# EAGLE design TIA Schematic 19 Jan 2017 (EAGLE 6.6.0)
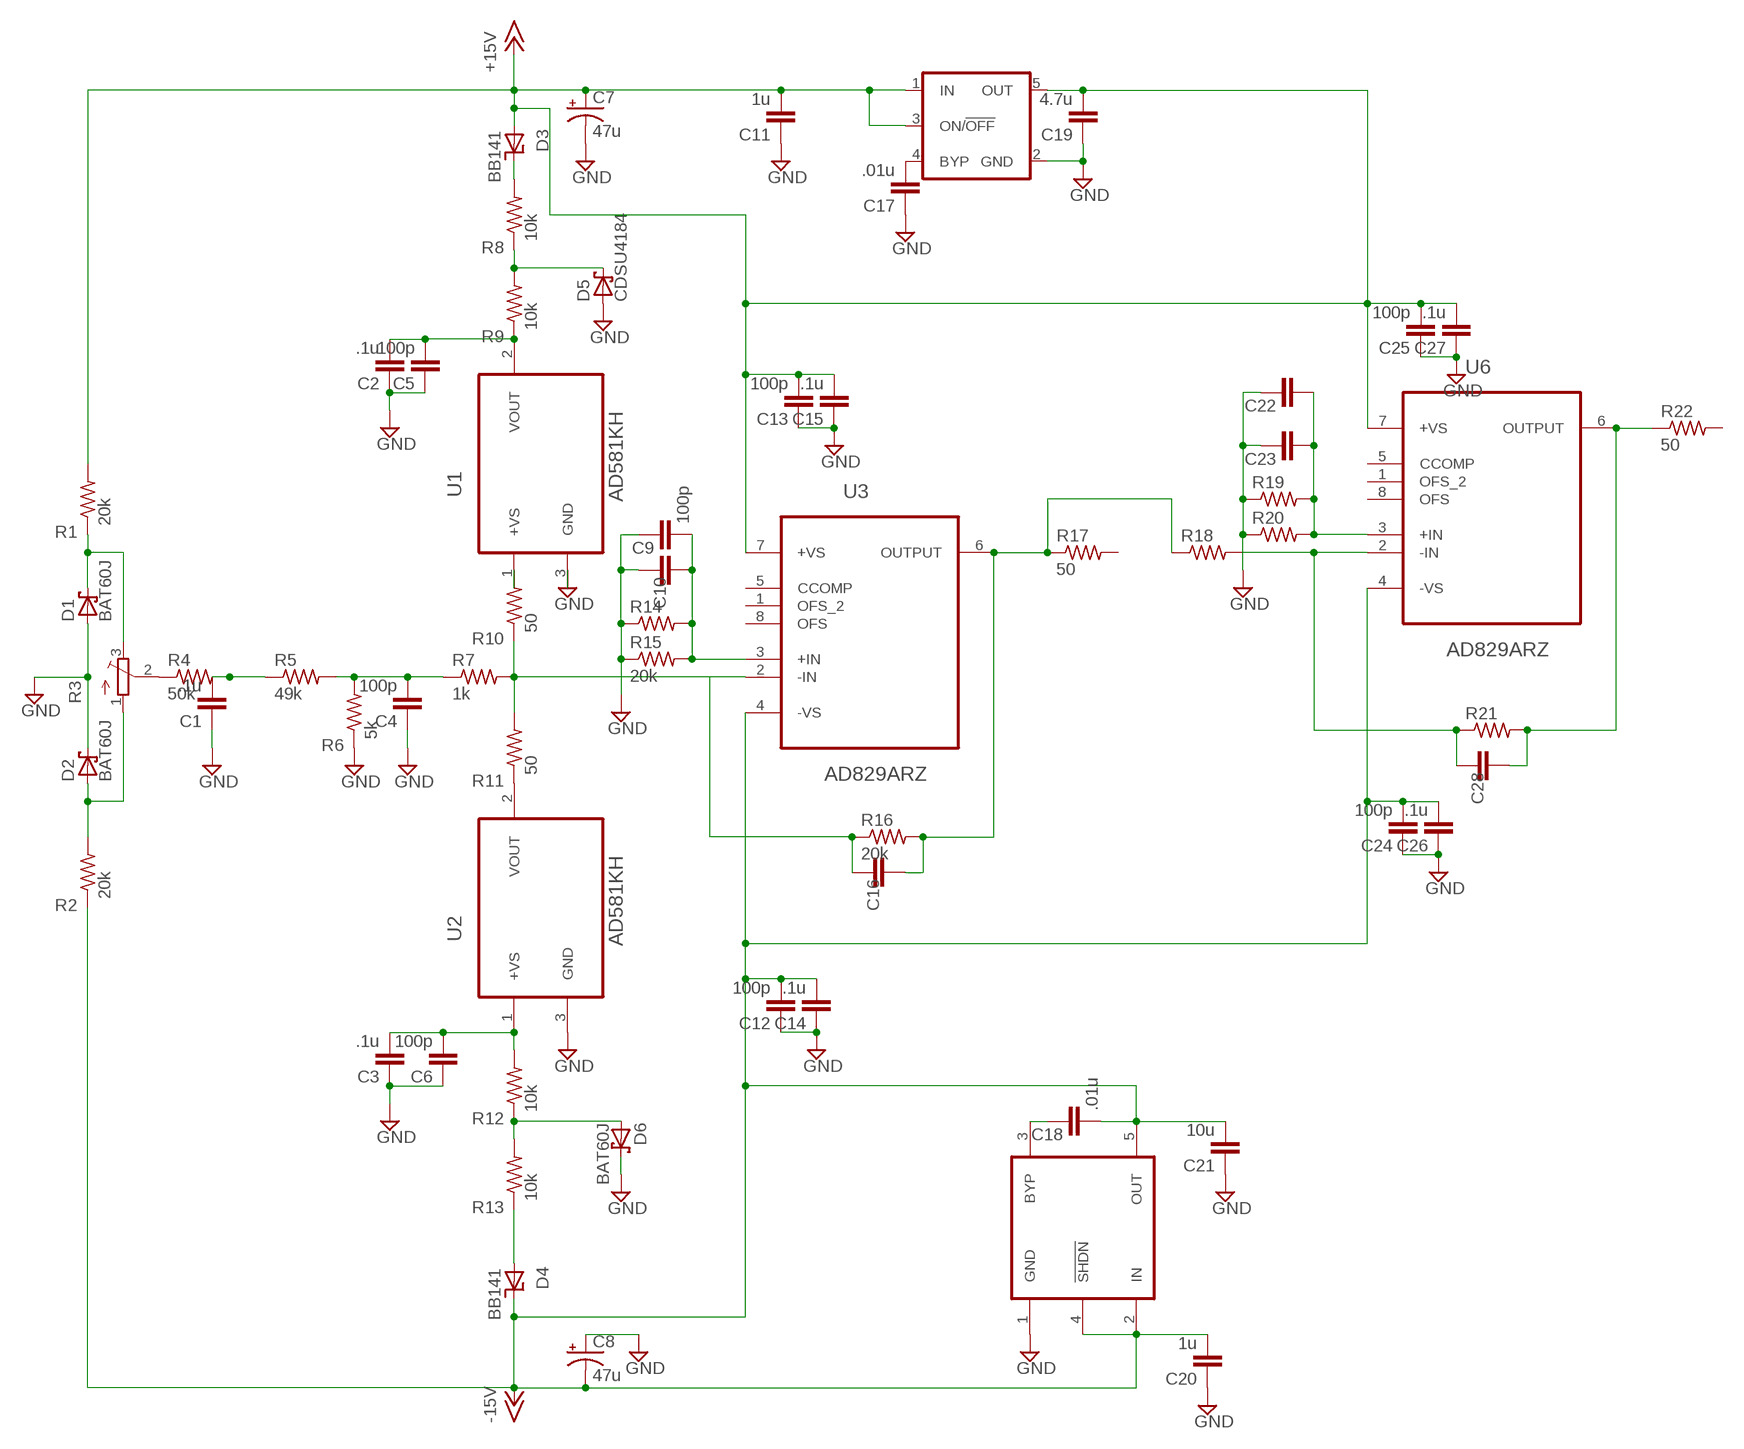
[diagram p0: schematic, sheet 1]

## Parts
C1  .1u  C-EUC0603  [C0603]
C2  .1u  C-EUC0603  [C0603]
C3  .1u  C-EUC0603  [C0603]
C4  100p  C-EUC0603  [C0603]
C5  100p  C-EUC0603  [C0603]
C6  100p  C-EUC0603  [C0603]
C7  47u  CPOL-USETR3  [ETR3]
C8  47u  CPOL-USETR3  [ETR3]
C9  100p  C-EUC0603  [C0603]
C10  C-EUC0603  [C0603]
C11  1u  C-EUC0603  [C0603]
C12  100p  C-EUC0603  [C0603]
C13  100p  C-EUC0603  [C0603]
C14  .1u  C-EUC0603  [C0603]
C15  .1u  C-EUC0603  [C0603]
C16  C-EUC0603  [C0603]
C17  .01u  C-EUC0603  [C0603]
C18  .01u  C-EUC0603  [C0603]
C19  4.7u  C-EUC0603  [C0603]
C20  1u  C-EUC0603  [C0603]
C21  10u  C-EUC0603  [C0603]
C22  C-EUC0603  [C0603]
C23  C-EUC0603  [C0603]
C24  100p  C-EUC0603  [C0603]
C25  100p  C-EUC0603  [C0603]
C26  .1u  C-EUC0603  [C0603]
C27  .1u  C-EUC0603  [C0603]
C28  C-EUC0603  [C0603]
D1  BAT60J  [SOD323_ST]
D2  BAT60J  [SOD323_ST]
D3  BB141  [SOD523]
D4  BB141  [SOD523]
D5  CDSU4184  BAT60J  [SOD323_ST]
D6  BAT60J  [SOD323_ST]
R1  20k  R-US_R0603  [R0603]
R2  20k  R-US_R0603  [R0603]
R3  TRIM_EU-3223G  [3223G]
R4  50k  R-US_R0603  [R0603]
R5  49k  R-US_R0603  [R0603]
R6  5k  R-US_R0603  [R0603]
R7  1k  R-US_R0603  [R0603]
R8  10k  R-US_R0603  [R0603]
R9  10k  R-US_R0603  [R0603]
R10  50  R-US_R0603  [R0603]
R11  50  R-US_R0603  [R0603]
R12  10k  R-US_R0603  [R0603]
R13  10k  R-US_R0603  [R0603]
R14  R-US_R0603  [R0603]
R15  20k  R-US_R0603  [R0603]
R16  20k  R-US_R0603  [R0603]
R17  50  R-US_R0603  [R0603]
R18  R-US_R0603  [R0603]
R19  R-US_R0603  [R0603]
R20  R-US_R0603  [R0603]
R21  R-US_R0603  [R0603]
R22  50  R-US_R0603  [R0603]
U1  AD581KH  [TO254P939X470-3P]
U2  AD581KH  [TO254P939X470-3P]
U3  AD829ARZ  [SOIC127P600X175-8N]
U4  LP2992M5  [SOT23-5]
U5  LT1964  [SOT23-5]
U6  AD829ARZ  [SOIC127P600X175-8N]

## Nets
+15V: C7.+ C11.2 C13.2 C15.2 C19.2 C25.2 C27.2 D3.A R1.2 U3.7(+VS) U4.1(IN) U4.3(ON/!OFF!) U4.5(OUT) U6.7(+VS)
-15V: C8.- C12.2 C14.2 C18.2 C20.2 C21.2 C24.2 C26.2 D4.C R2.1 U3.4(-VS) U5.2(IN) U5.4(!SHDN!) U5.5(OUT) U6.4(-VS)
GND: C1.1 C2.1 C3.1 C4.1 C5.1 C6.1 C7.- C8.+ C9.1 C10.1 C11.1 C12.1 C13.1 C14.1 C15.1 C17.1 C19.1 C20.1 C21.1 C22.1 C23.1 C24.1 C25.1 C26.1 C27.1 D1.A D2.C D5.A D6.C R6.1 R14.1 R15.1 R19.1 R20.1 U1.3(GND) U2.3(GND) U4.2(GND) U5.1(GND)
N$1: D3.C R8.2
N$2: R3.2(S) R4.1
N$3: C4.2 R5.2 R6.2 R7.1
N$4: C1.2 R4.2 R5.1
N$5: C9.2 C10.2 R14.2 R15.2 U3.3(+IN)
N$6: C16.2 R16.2 R17.1 R18.1 U3.6(OUTPUT)
N$7: C16.1 R7.2 R10.1 R11.2 R16.1 U3.2(-IN)
N$8: D5.C R8.1 R9.2
N$9: R10.2 U1.1(+VS)
N$10: R11.1 U2.2(VOUT)
N$11: C3.2 C6.2 R12.2 U2.1(+VS)
N$12: D6.A R12.1 R13.2
N$13: D4.A R13.1
N$14: D1.C R1.1 R3.3(E)
N$15: D2.A R2.2 R3.1(A)
N$17: C2.2 C5.2 R9.1 U1.2(VOUT)
N$22: C28.1 R18.2 R21.1 U6.2(-IN)
N$23: C22.2 C23.2 R19.2 R20.2 U6.3(+IN)
N$24: C17.2 U4.4(BYP)
N$25: C18.1 U5.3(BYP)
N$26: C28.2 R21.2 R22.1 U6.6(OUTPUT)
Unconnected: R17.2 R22.2 U3.1(OFS_2) U3.5(CCOMP) U3.8(OFS) U6.1(OFS_2) U6.5(CCOMP) U6.8(OFS)

## Library data of the parts
C1-C6 C9-C28 = rcl:C-EU: CAPACITOR, European symbol
C7 C8 = rcl:CPOL-US: POLARIZED CAPACITOR, American symbol
D1 D2 D5 D6 = diode:BAT60J: Schottky barrier diode Source: www.st.com, BAT60J.pdf
D3 D4 = mylibrary:BB141: Diode SOD-523
R1 R2 R4-R22 = rcl:R-US_: RESISTOR, American symbol
R3 = pot:TRIM_EU-: POTENTIOMETER
U1 U2 = Analog Devices_By_element14_Batch_1:AD581KH: High Precision 10 V IC Reference; MPN: AD581KH; OC_FARNELL: 4414640; OC_NEWARK: 05F7034; PACKAGE: TO-5-3; SUPPLIER: Analog Devices
U3 U6 = Analog Devices_By_element14_Batch_1:AD829ARZ: High Speed, Low Noise Video Op Amp; MPN: AD829ARZ; OC_FARNELL: 1651322; OC_NEWARK: 82H3000; PACKAGE: SOIC-8; SUPPLIER: Analog Devices
U4 = LP2992M5:LP2992M5
U5 = LT1964:LT1964

## Board
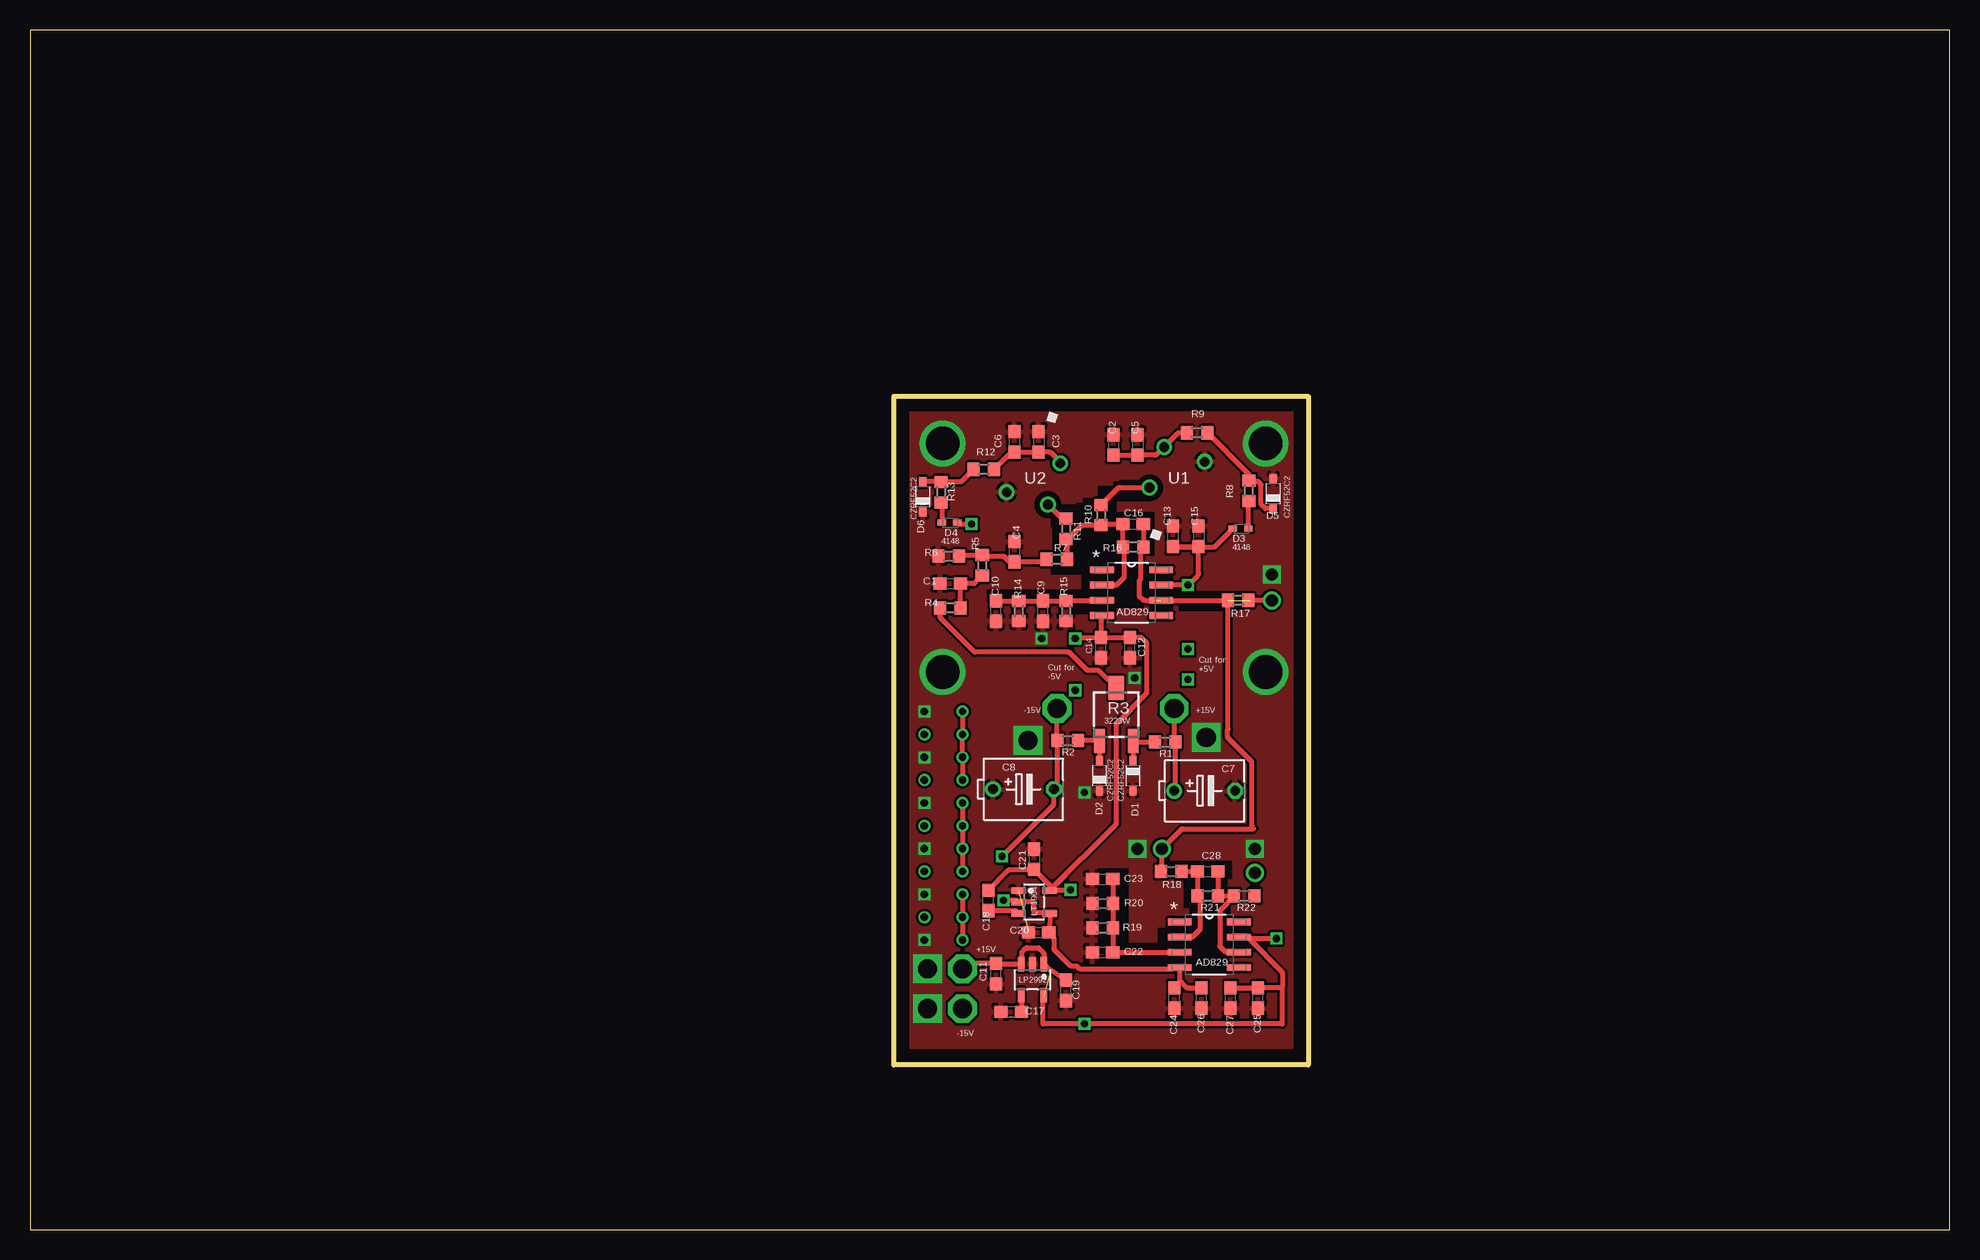
[diagram p1: board, top side]
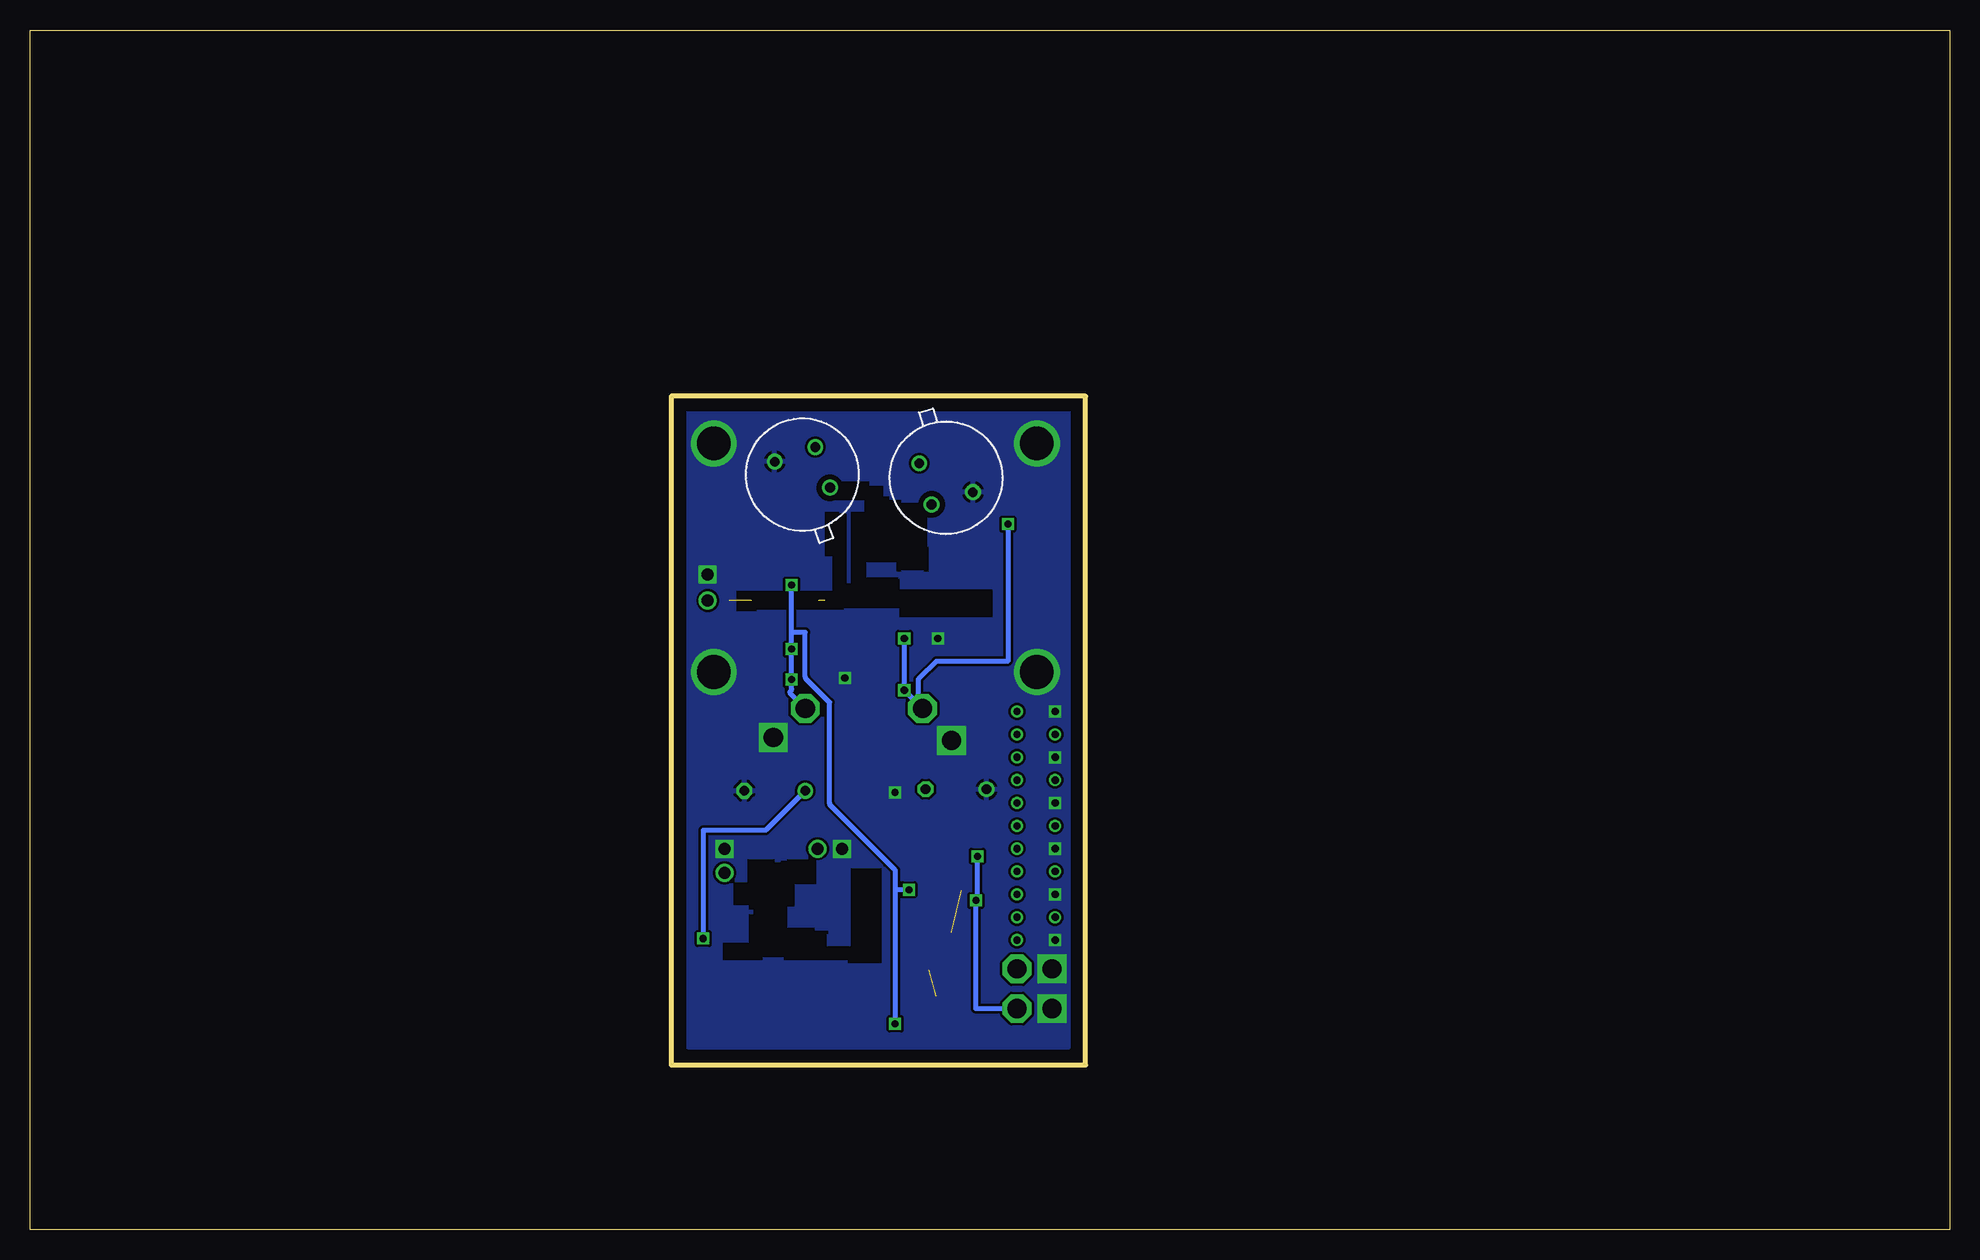
[diagram p2: board, bottom side, seen from below]

Size 160 x 100 mm. Coordinates in mm from the lower left corner, seen from the top.
Outline: 0,0 160,0 160,100 0,100 0,0
Outline: 72.01,69.47 106.55,69.47 106.55,13.72 72.01,13.72 72.01,69.47
Copper layers (1*16): Top 0.035mm / dielectric 1.5mm / Bottom 0.035mm
Design rules "default": minimum track width 10mil, minimum drill 24mil, track to track 8mil, track to pad 8mil, pad to pad 8mil, via to via 8mil, smd to smd 8mil, copper to edge 40mil, drill to drill 8mil, minimum pad ring 10mil, minimum via ring 8mil, stop-mask expansion 4mil, vias tented up to drill 0mil, thermal gap 10mil
tRestrict: area 95.8,51.6 to 100.8,53.2; area 86.1,55 to 87.8,57.4; area 87.2,55.9 to 90.9,58.2; area 85.1,58.5 to 87.6,60.5; area 89,61 to 90.8,62; area 90.8,61.6 to 93,62.5; area 90.3,61.7 to 91.2,62.4; area 89.5,60.7 to 93.2,61.6; area 96.5,21.3 to 99.9,24.1; area 85.2,56.9 to 85.9,58.7; area 87.2,59.1 to 88,60.6; area 87.6,52.8 to 90.9,55.9; 22 more areas
bRestrict: area 83.9,59.6 to 85.7,61.4; area 92.4,61 to 94.2,62.7; area 79.8,51.1 to 87.5,53.3; area 87.4,51.8 to 90.9,53.1; area 87.5,53.2 to 91.1,54.2; area 87.6,54 to 91.1,54.4; area 90.3,53.7 to 91.6,59.8; area 90,60.8 to 93.2,62.4; area 88.9,60.1 to 90.4,62; area 88.4,57.9 to 90.3,61.1; area 86.6,57.9 to 88.4,59.3; area 85.2,56.8 to 87.5,60.1; 39 more areas

### Footprints (pad centres in the part's own frame; a part is rotated, then mirrored left to right if it is on the bottom)
C0603 = smd 1.1 x 1: 1 -0.85,0; 2 0.85,0
ETR3 = drill 0.813: + -2.54,0 | drill 0.813 octagon: - 2.54,0
SOD323_ST = smd 0.8 x 0.6: A 1.25,0; C -1.25,0
SOD523 = smd 0.7 x 0.5: A 0.7,0; C -0.6,0
R0603 = smd 1 x 1.1: 1 -0.85,0; 2 0.85,0
3223G = smd 2 x 0.9: 1 -2.2,1.4; 3 -2.2,-1.4 | smd 2 x 1.3: 2 2.2,0
TO254P939X470-3P = drill 0.813: 1 -5.08,0; 2 -2.54,-2.54; 3 0,0
SOIC127P600X175-8N = smd 1.981 x 0.559: 1 -2.464,1.905; 2 -2.464,0.635; 3 -2.464,-0.635; 4 -2.464,-1.905; 5 2.464,-1.905; 6 2.464,-0.635; 7 2.464,0.635; 8 2.464,1.905
SOT23-5 = smd 0.55 x 1.2: 1 -0.95,-1.3; 2 0,-1.3; 3 0.95,-1.3; 4 0.95,1.3; 5 -0.95,1.3

### Placement (x,y rotation side)
C1  76.71,53.85 0 top
C2  90.3,65.41 270 top
C3  84.07,65.66 270 top
C4  82.04,56.52 270 top
C5  92.33,65.41 270 top
C6  82.04,65.66 270 top
C7  97.92,36.58 0 top
C8  82.8,36.7 0 top
C9  84.45,51.56 90 top
C10  80.52,51.56 90 top
C11  80.52,21.34 90 top
C12  91.69,48.51 90 top
C13  95.25,57.78 270 top
C14  89.28,48.51 90 top
C15  97.41,57.78 270 top
C16  91.95,58.8 0 top
C17  81.79,18.16 0 top
C18  79.88,27.43 90 top
C19  86.36,19.94 90 top
C20  84.07,24.77 0 top
C21  83.69,30.86 270 top
C22  89.41,23.11 0 top
C23  89.41,29.21 0 top
C24  95.38,19.3 90 top
C25  102.36,19.3 90 top
C26  97.66,19.3 90 top
C27  100.08,19.3 90 top
C28  98.17,29.84 0 top
D1  91.95,37.85 270 top
D2  89.15,37.85 90 top
D3  100.97,58.42 180 top
D4  76.71,58.93 180 top
D5  103.63,61.34 90 top
D6  74.42,61.09 90 top
R1  94.61,40.64 0 top
R2  86.49,40.77 0 top
R3  90.55,42.93 90 top
R4  76.71,51.82 0 top
R5  79.38,55.37 90 top
R6  76.58,56.13 0 top
R7  85.6,55.88 0 top
R8  101.6,61.59 270 top
R9  97.28,66.42 0 top
R10  89.28,59.56 90 top
R11  86.36,58.42 270 top
R12  79.5,63.37 0 top
R13  75.95,61.47 90 top
R14  82.42,51.56 90 top
R15  86.36,51.56 90 top
R16  91.95,56.9 0 top
R17  100.71,52.45 0 top
R18  95.12,29.84 0 top
R19  89.41,25.15 0 top
R20  89.41,27.18 0 top
R21  98.17,27.81 0 top
R22  101.22,27.81 0 top
U1  97.92,64.01 155 bottom
U2  81.41,61.47 331.7 bottom
U3  91.82,53.09 0 top
U4  83.57,20.83 180 top
U5  83.69,27.3 270 top
U6  98.3,23.75 0 top

### Tracks (layer width: path | path; a pad name or v marks a point on that pad's centre or on a via)
+15V  (via drill 0.6, 1.6)  (2 unrouted)
  Top 0.406: C27.2 C25.2 104.3,20.15 arc45 104.39,20.19 | 97.41,56.9 95.34,56.9 arc-45 C13.2 C15.2 97.41,56.9 | C7.+ 95.39,36.59 arc45 95.47,36.77 R1.2 95.45,40.65 arc-45 95.38,40.83 v95.38,43.43 | 97.41,56.9 97.41,54.72 arc-45 97.33,54.54 v96.52,53.72 U3.7 | 104.39,20.19 104.39,17.14 84.45,17.14 84.45,19.43 | C19.2 85.12,21.63 arc-45 84.94,21.7 U4.1 84.52,22.95 arc45 84.44,23.13 84.07,23.5 83.16,23.5 arc45 82.98,23.42 82.68,23.11 82.68,22.27 arc-45 U4.3 80.66,22.13 arc-45 C11.2 77.72,22.19 v77.72,21.72 | 101.6,24.26 v103.89,24.26 | 101.6,24.26 104.32,21.54 arc-45 104.39,21.36 104.39,20.19 | 101.6,24.26 101.55,24.31 arc45 101.37,24.38 U6.7 | 97.41,56.9 98.74,56.9 D3.A
  Bottom 0.406: v95.38,43.43 96.57,44.63 arc45 96.65,44.81 96.59,44.86 arc-45 96.52,45.04 v96.52,45.85 v96.52,48.39 96.52,49.78 | 96.52,49.78 v96.52,53.72 | C7.+ 98.61,33.35 arc45 98.78,33.27 103.89,33.27 v103.89,24.26 | 96.52,49.78 95.38,49.78 95.38,46.08 arc-45 95.3,45.9 93.34,43.94 93.34,35.54 arc-45 93.27,35.36 87.88,29.97 v87.88,17.14
-15V  (via drill 0.6, 1.6)
  Top 0.406: U3.4 U3.4 arc45 89.28,51 C14.2 | C14.2 C12.2 92.52,49.36 arc-45 92.7,49.29 93.09,48.9 93.09,44.81 arc-45 93.02,44.63 90.55,42.16 90.55,33.92 arc-45 90.48,33.74 U5.5 | C14.2 89.3,49.35 arc45 89.47,49.28 | C24.2 95.76,20.54 arc45 95.83,20.72 | 95.83,20.72 U6.4 95.48,21.84 arc45 95.3,21.77 95.25,21.72 87.61,21.72 arc-45 87.43,21.79 87.25,21.97 86.85,21.97 arc-45 86.67,22.05 85.34,23.37 85.34,24.24 arc45 85.27,24.42 C20.2 85.05,26.38 | 95.83,20.72 96.32,20.23 arc45 96.5,20.15 C26.2 | D4.C 77.36,58.88 arc45 77.54,58.8 v78.49,58.8 | v85.6,43.43 85.6,40.86 arc45 R2.1 85.64,37.1 arc-45 85.56,36.92 C8.- 85.34,35.54 arc-45 85.27,35.36 v81.03,31.11 | v87.12,49.28 87.14,49.29 arc-45 87.31,49.36 C14.2 | U5.4 arc-45 85.05,26.38 | U5.5 84.99,28.61 arc45 84.92,28.79 C21.2 81.72,30.01 arc45 81.54,29.94 C18.2 | v81.15,27.43 82.16,27.43 arc-45 82.34,27.36 U5.2 83.69,27.3 83.69,26.38 85.05,26.38 | U5.5 86.18,29.44 arc-45 86.23,29.46 | U5.5 arc-45 85.15,28.32 v86.74,28.32
  Bottom 0.406: v85.6,43.43 85.98,43.81 | 85.98,43.81 87.05,44.88 arc45 87.12,45.06 v87.12,49.28 | v78.49,58.8 78.49,47.37 84.45,47.37 85.91,45.92 arc-45 85.98,45.74 85.98,43.81 | v81.03,31.11 81.03,27.66 arc45 81.1,27.48 v81.15,27.43 81.15,18.41 v77.72,18.41 | v86.74,28.32 87.63,28.32
GND  (via drill 0.6, 1, 1.6, 2.8 pad 1.68)  (1 unrouted)
  other vias: 103,46.48 76.07,46.48 76.07,65.53 103,65.53 103.5,54.61 102.11,31.75 83.19,40.77 98.04,41.02 92.33,31.75 84.33,49.28 92.08,45.97 87.88,36.45 74.55,43.18 74.55,39.37 74.55,35.56 74.55,31.75 74.55,27.94 74.8,18.41 74.8,21.72 74.55,24.13
  pour Bottom: 73.41,68.33 105.16,68.33 105.16,15.24 73.41,15.24
  pour Top: 73.41,68.33 105.16,68.33 105.16,15.24 73.41,15.24
N$1
  Top 0.406: D3.C 101.56,60.71 R8.2
N$2
  Top 0.406: R3.2 89.14,46.53 arc45 88.96,46.61 88.14,46.61 86.69,48.06 arc45 86.51,48.13 78.74,48.13 75.93,50.94 arc-45 75.86,51.12 R4.1
N$3
  Top 0.406: R7.1 84.61,55.74 arc-45 84.43,55.66 C4.2 81.73,55.66 arc-45 81.55,55.74 81.15,56.13 79.57,56.13 arc-45 79.39,56.21 R5.2 77.62,56.22 arc45 77.44,56.15 R6.2
N$4
  Top 0.406: R5.1 78.78,53.92 arc-45 78.6,53.85 C1.2 R4.2
N$5
  Top 0.406: C10.2 R14.2 C9.2 R15.2 arc-45 86.45,52.45 U3.3
N$6  (via drill 1)  (2 unrouted)
  Top 0.406: C16.2 R16.2 92.66,56.76 arc45 92.58,56.58 92.58,54.23 92.53,54.18 arc45 92.46,54 92.46,52.83 92.76,52.52 arc45 92.94,52.45 93.73,52.45 | U3.6 R17.1 99.86,41.75 arc-45 99.82,41.66 99.82,41.13 arc45 99.9,40.95 101.85,38.99 101.85,33.63 arc45 101.93,33.45 101.98,33.4 96.12,33.4 arc45 95.94,33.33 v94.36,31.75 94.36,30.04 arc-45 94.29,29.86 R18.1 | v103.5,52.45 101.73,52.45
N$7
  Top 0.406: U3.2 90.45,53.72 arc45 90.62,53.8 91.19,54.36 91.19,56.7 arc45 91.11,56.88 R16.1 C16.1 89.47,58.8 arc45 89.3,58.73 R10.1 87.77,58.71 arc45 87.59,58.64 86.49,57.53 86.45,57.53 | R11.2 arc45 86.45,57.53 | 86.45,57.53 arc45 86.45,57.52 R7.2
N$8
  Top 0.406: R9.2 101.53,63.03 arc-45 101.6,62.85 R8.1 101.69,62.36 102.36,62.36 102.62,62.1 102.62,60.45 102.98,60.09 D5.C
N$9
  Top 0.406: R10.2 90.66,61.79 arc-45 90.83,61.86 U1.1
N$10
  Top 0.406: U2.2 85.94,59.34 arc45 86.12,59.27 R11.1
N$11
  Top 0.406: U2.1 arc-45 85.85,63.94 85.85,64.01 85.12,64.73 arc45 84.95,64.81 C3.2 C6.2 81.89,64.81 arc45 81.71,64.73 R12.2
N$12
  Top 0.406: R12.1 77.67,62.39 arc-45 77.49,62.32 R13.2 arc45 75.9,62.34 D6.A
N$13
  Top 0.406: R13.1 arc-45 76.01,60.47 D4.A
N$14
  Top 0.406: D1.C R3.3 arc-45 R3.3 91.96,40.71 arc45 92.14,40.64 R1.1
N$15
  Top 0.406: R2.2 89.05,40.77 arc-45 R3.1 arc-45 R3.1 D2.A
N$17
  Top 0.406: R9.1 95.83,66.42 arc45 95.65,66.35 U1.2 93.93,64.63 arc-45 93.75,64.56 C5.2 C2.2
N$22
  Top 0.406: R18.2 C28.1 R21.1 97.46,27.67 arc-45 97.54,27.49 97.54,25.02 96.97,24.46 arc-45 96.8,24.38 U6.2
N$23
  Top 0.406: C23.2 R20.2 R19.2 C22.2 U6.3
N$24
  Top 0.406: U4.4 arc-45 82.64,19.48 C17.2
N$25
  Top 0.406: U5.3 82.24,26.51 arc45 82.06,26.58 C18.1
N$26
  Top 0.406: C28.2 R21.2 R22.1 99.26,26.7 arc45 99.19,26.53 99.19,23.62 99.62,23.19 arc45 99.8,23.11 U6.6
N$31  (via drill 0.6)
  other vias: 74.55,26.04
N$33  (via drill 0.6)
  Top 0.406: v77.72,27.94 v77.72,26.04 v77.72,24.13
N$35  (via drill 1)
  other vias: 102.11,29.72
N$36  (via drill 0.6)
  other vias: 74.55,29.84
N$40  (via drill 0.6)
  other vias: 74.55,33.66
N$43  (via drill 0.6)
  other vias: 87.12,44.96
N$44  (via drill 0.6)
  other vias: 74.55,37.47
N$45  (via drill 0.6)
  other vias: 74.55,41.27
N$47  (via drill 0.6)
  Top 0.406: v77.72,43.18 v77.72,41.27 v77.72,39.37 v77.72,37.47
N$50  (via drill 0.6)
  Top 0.406: v77.72,35.56 v77.72,33.66 v77.72,31.75 v77.72,29.84

### Text on the board
tNames: CZRF52C2 | CZRF52C2 | 4148 | 4148 | AD829 | Cut for / -5V | Cut for / +5V | -15V | +15V | 3223W | CZRF52C2 | CZRF52C2 | LT1964 | +15V | AD829 | LP2992 | -15V